# Altium schematic sheet BLE113.SchDoc: Transiently Powered Computers
size Letter; Author: Hrishikesh Jayakumar; DrawnBy: 2; Engineer: Hrishikesh; Organization: Embedded Systems Lab; Address1: 465 Northwestern Avenue; Address2: ECE Dept; Address3: Purdue University; Address4: West Lafayette, IN 47907; DocumentNumber: 5; Revision: B; SheetNumber: 5; SheetTotal: 6; DocumentName: ISHIDDEN=T
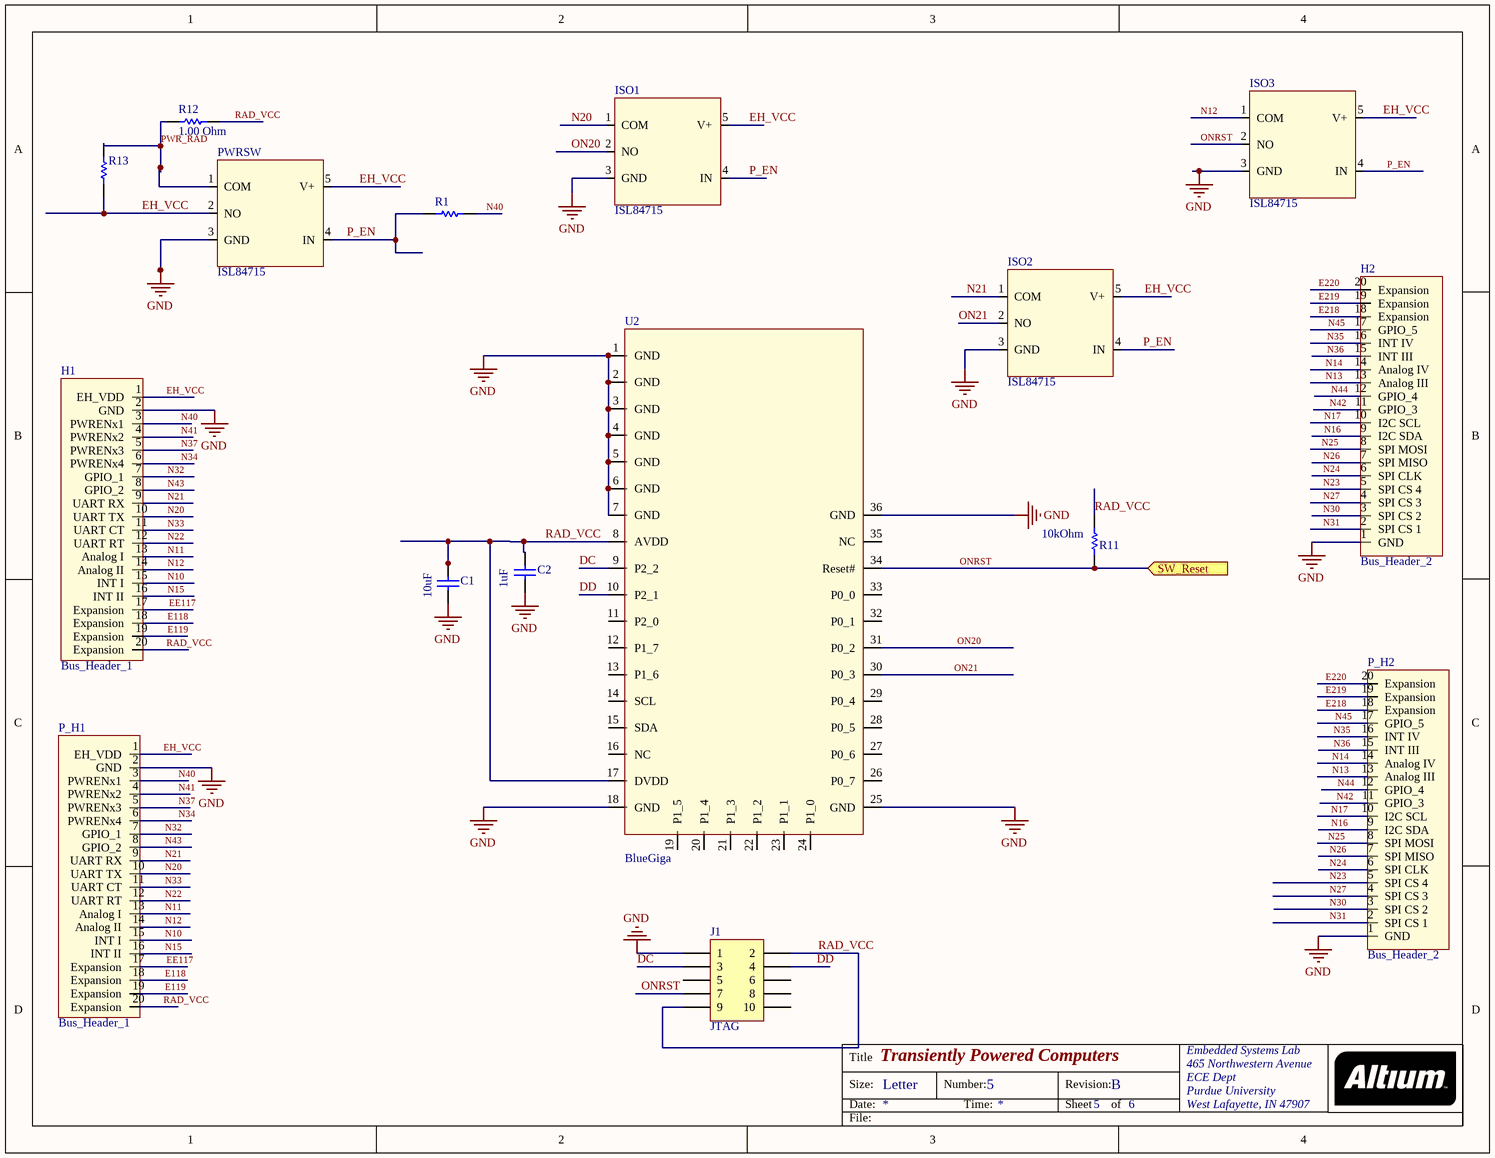
[diagram p0: BLE113.SchDoc]

## Parts
C1  value 10uF  [CAPC0402(1005)60_N]  (hidden comment: CAP 470nF 4V 0402(1005))
C2  value 1uF  [CAPC0402(1005)60_N]  (hidden comment: CAP 470nF 4V 0402(1005))
H1  Bus_Header_1  [Male Single row 20 pin header]
H2  Bus_Header_2  [Male Single row 20 pin header]
ISO1  ISL84715  [ISL84715]
ISO2  ISL84715  [ISL84715]
ISO3  ISL84715  [ISL84715]
J1  JTAG  [FTSH-105-XX-X-DV]
P_H1  Bus_Header_1  [SMT 20 -pin single row female header]
P_H2  Bus_Header_2  [SMT 20 -pin single row female header]
PWRSW  ISL84715  [ISL84715]
R1  Jumper 0402(1005)  [RESC0402(1005)_N]  (value not drawn)
R11  value 10kOhm  [RESC0805(2012)_M]  (hidden comment: 5R1 5% 0805(2012))
R12  value 1.00 Ohm  [RESC0402(1005)_N]  (hidden comment: 1R 5% 0402(1005))
R13  Jumper 0402(1005)  [RESC0402(1005)_N]  (value not drawn)
U2  BlueGiga  [BlueGiga]

## Ports
SW_Reset (in)

## Nets
GND: C1.1 C2.1 H1.2(GND) H2.1(GND) ISO1.3(GND) ISO2.3(GND) ISO3.3(GND) J1.1 P_H1.2(GND) P_H2.1(GND) PWRSW.3(GND) U2.1(GND) U2.2(GND) U2.3(GND) U2.4(GND) U2.5(GND) U2.6(GND) U2.7(GND) U2.18(GND) U2.25(GND) U2.36(GND)
DC: J1.3 U2.9(P2_2)
DD: J1.4 U2.10(P2_1)
E118: H1.18(Expansion) P_H1.18(Expansion)
E119: H1.19(Expansion) P_H1.19(Expansion)
E218: H2.18(Expansion) P_H2.18(Expansion)
E219: H2.19(Expansion) P_H2.19(Expansion)
E220: H2.20(Expansion) P_H2.20(Expansion)
EE117: H1.17(Expansion) P_H1.17(Expansion)
EH_VCC: H1.1(EH_VDD) ISO1.5(V+) ISO2.5(V+) ISO3.5(V+) P_H1.1(EH_VDD) PWRSW.2(NO) PWRSW.5(V+) R13.1
N10: H1.15(INT_I) P_H1.15(INT_I)
N11: H1.13(Analog_I) P_H1.13(Analog_I)
N12: H1.14(Analog_II) ISO3.1(COM) P_H1.14(Analog_II)
N13: H2.13(Analog_III) P_H2.13(Analog_III)
N14: H2.14(Analog_IV) P_H2.14(Analog_IV)
N15: H1.16(INT_II) P_H1.16(INT_II)
N16: H2.9(I2C_SDA) P_H2.9(I2C_SDA)
N17: H2.10(I2C_SCL) P_H2.10(I2C_SCL)
N20: H1.10(UART_TX) ISO1.1(COM) P_H1.10(UART_TX)
N21: H1.9(UART_RX) ISO2.1(COM) P_H1.9(UART_RX)
N22: H1.12(UART_RT) P_H1.12(UART_RT)
N23: H2.5(SPI_CS_4) P_H2.5(SPI_CS_4)
N24: H2.6(SPI_CLK) P_H2.6(SPI_CLK)
N25: H2.8(SPI_MOSI) P_H2.8(SPI_MOSI)
N26: H2.7(SPI_MISO) P_H2.7(SPI_MISO)
N27: H2.4(SPI_CS_3) P_H2.4(SPI_CS_3)
N30: H2.3(SPI_CS_2) P_H2.3(SPI_CS_2)
N31: H2.2(SPI_CS_1) P_H2.2(SPI_CS_1)
N32: H1.7(GPIO_1) P_H1.7(GPIO_1)
N33: H1.11(UART_CT) P_H1.11(UART_CT)
N34: H1.6(PWRENx4) P_H1.6(PWRENx4)
N35: H2.16(INT_IV) P_H2.16(INT_IV)
N36: H2.15(INT_III) P_H2.15(INT_III)
N37: H1.5(PWRENx3) P_H1.5(PWRENx3)
N40: H1.3(PWRENx1) P_H1.3(PWRENx1) R1.2
N41: H1.4(PWRENx2) P_H1.4(PWRENx2)
N42: H2.11(GPIO_3) P_H2.11(GPIO_3)
N43: H1.8(GPIO_2) P_H1.8(GPIO_2)
N44: H2.12(GPIO_4) P_H2.12(GPIO_4)
N45: H2.17(GPIO_5) P_H2.17(GPIO_5)
ON20: ISO1.2(NO) U2.31(P0_2)
ON21: ISO2.2(NO) U2.30(P0_3)
ONRST: ISO3.2(NO) J1.7 R11.1 U2.34(Reset#) ; port SW_Reset
P_EN: ISO1.4(IN) ISO2.4(IN) ISO3.4(IN) PWRSW.4(IN) R1.1
PWR_RAD: PWRSW.1(COM) R12.2 R13.2
RAD_VCC: C1.2 C2.2 H1.20(Expansion) J1.2 J1.9 P_H1.20(Expansion) R11.2 R12.1 U2.8(AVDD) U2.17(DVDD)

Not connected (* = marked no-connect by the designer): J1 5 6 8 10; U2 11(P2_0) 12(P1_7) 13(P1_6) 14(SCL) 15(SDA) 16(NC) 19(P1_5) 20(P1_4) 21(P1_3) 22(P1_2) 23(P1_1) 24(P1_0) 26(P0_7) 27(P0_6) 28(P0_5) 29(P0_4) 32(P0_1) 33(P0_0) 35(NC)

## Notes on the sheet
- Title
- Size:
- Date:
- Letter
- Number:
- Time:
- Revision:
- Sheet
- of
- File:

## Library data of the parts
C1 C2 = CMP-1034-02101-1: CAP 470nF 4V ±10% 0402 (1005 Metric) Thickness 0.6mm SMD; Case-EIA: 0402; Case-Metric: 1005; Tolerance: ±10%; Technology: SMT; Rated Voltage: 4 V; Max Thickness: 0.6 mm
J1 = CC_JTAG: Supplier 1: Newark; Supplier Part Number 1: 11P4477
R1 R13 = CMP-1011-00001-1: Jumper 0402 (1005 Metric); Tolerance: None; Case-Metric: 1005; Case-EIA: 0402; Value: 0.00 Ohm; Power: None; Technology: SMT
R11 = CMP-1013-00019-1: 5R1 0.125W 5% 0805 (2012 Metric)  SMD; Case-EIA: 0805; Case-Metric: 2012; Power: 0.125 W; Tolerance: 5 %; Technology: SMT
R12 = CMP-1011-00002-1: 1R 0.063W 5% 0402 (1005 Metric)  SMD; Case-Metric: 1005; Case-EIA: 0402; Power: 0.063 W; Technology: SMT; Tolerance: 5 %